# Altium project Mainboard.PrjPcb (part 1 of 2)
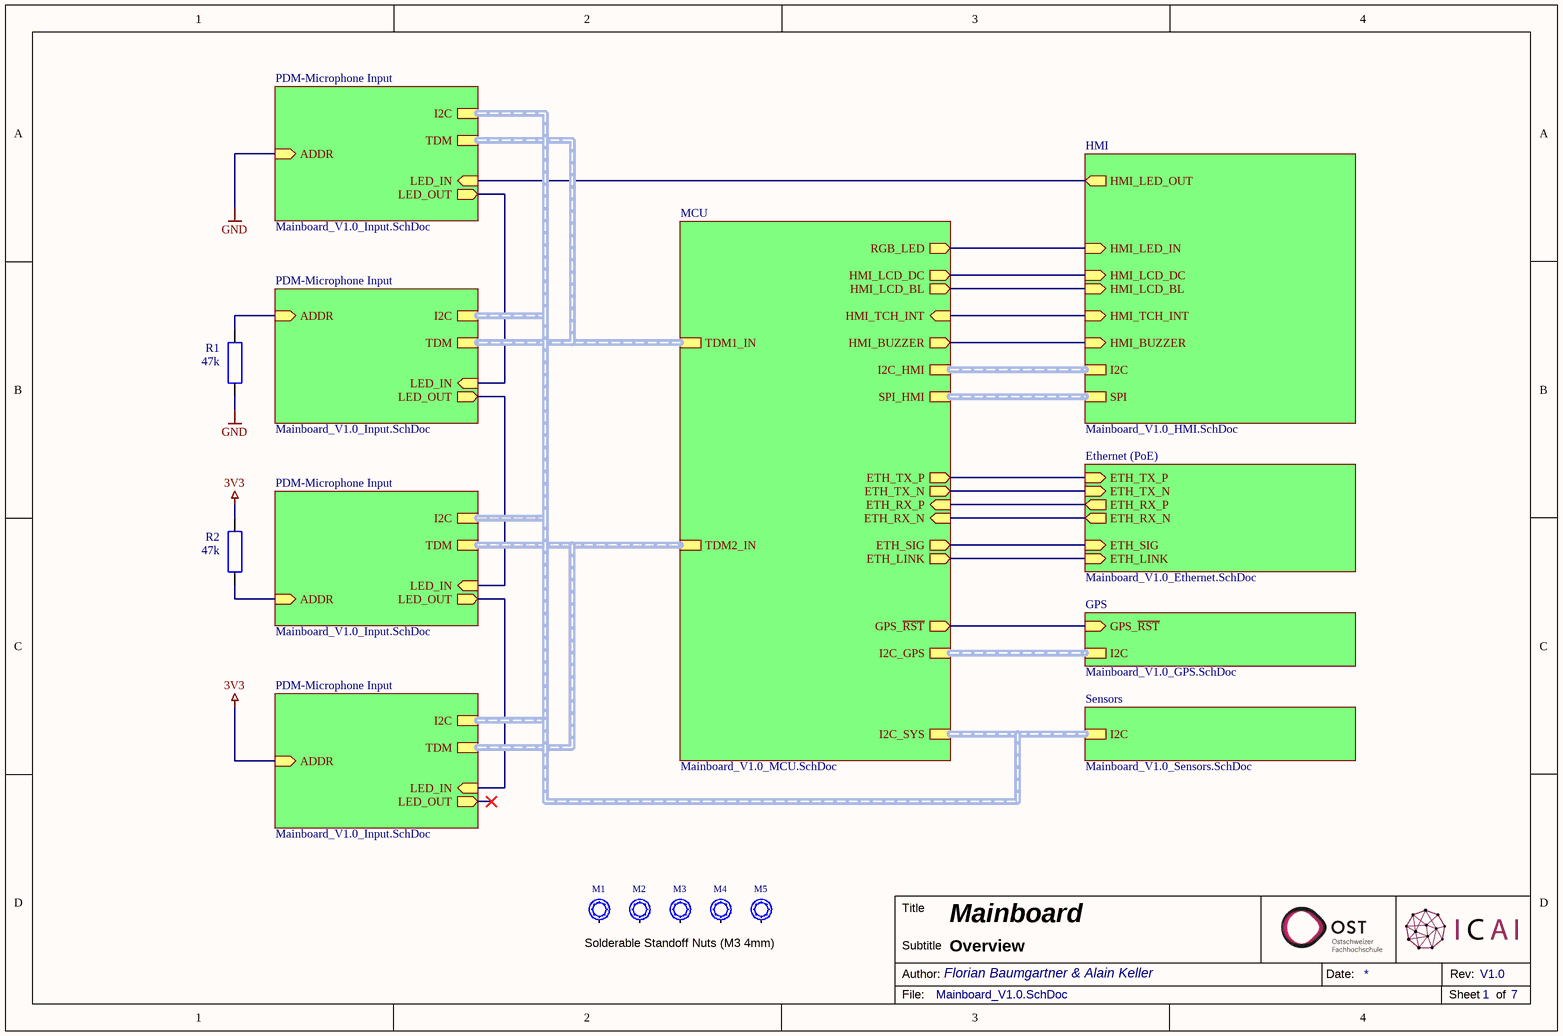
[diagram p0: Mainboard_V1.0.SchDoc]
7 sheets, 216 parts. Net scope: hierarchical (ports join the sheet entries above them; power ports are global).
Board file: Mainboard_V1.0.PcbDoc
Sheets:
  Mainboard_V1.0.SchDoc
    PDM-Microphone Input = Mainboard_V1.0_Input.SchDoc
    PDM-Microphone Input = Mainboard_V1.0_Input.SchDoc
    PDM-Microphone Input = Mainboard_V1.0_Input.SchDoc
    PDM-Microphone Input = Mainboard_V1.0_Input.SchDoc
    HMI = Mainboard_V1.0_HMI.SchDoc
    MCU = Mainboard_V1.0_MCU.SchDoc
    GPS = Mainboard_V1.0_GPS.SchDoc
    Sensors = Mainboard_V1.0_Sensors.SchDoc
    Ethernet (PoE) = Mainboard_V1.0_Ethernet.SchDoc

## Sheet Mainboard_V1.0.SchDoc: Mainboard
size A4; PageSetup: Record=PageOptions|CenterHorizontal=True|CenterVertical=True|PrintScale=0.97|XCorrection=1.00|YCorrection=1.00|PrintKind=0|BorderSize=5000000|LeftOffset=0|BottomOffset=0|Orientation=2|PaperLength=1000|PaperWidth=1000|Scale=100|PaperSource=7|PrintQuality=-3|MediaType=1|DitherType=10|PrintScaleMode=1|PaperKind=A4|PaperIndex=9; Organization: Ostschweizer Fachhochschule; Address2: Florian Baumgartner & Alain Keller; Address3: florian.baumgartner@ost.ch; DocumentNumber: 1; Revision: V1.0; SheetNumber: 1; SheetTotal: 7; Author: Florian Baumgartner & Alain Keller; Subtitle: Overview

### Parts
M1  SMTSO-M3-3ET  [SMD Solder-Nut (M3 4mm)]  (value not drawn)
M2  SMTSO-M3-3ET  [SMD Solder-Nut (M3 4mm)]  (value not drawn)
M3  SMTSO-M3-3ET  [SMD Solder-Nut (M3 4mm)]  (value not drawn)
M4  SMTSO-M3-3ET  [SMD Solder-Nut (M3 4mm)]  (value not drawn)
M5  SMTSO-M3-3ET  [SMD Solder-Nut (M3 4mm)]  (value not drawn)
R1  47k  [SMD Widerstand 0603]
R2  47k  [SMD Widerstand 0603]

### Sub-sheets
Ethernet (PoE) = Mainboard_V1.0_Ethernet.SchDoc: ETH_SIG (in), ETH_TX_P (in), ETH_RX_N (out), ETH_LINK (in), ETH_TX_N (in), ETH_RX_P (out)
GPS = Mainboard_V1.0_GPS.SchDoc: GPS_~{RST} (in), I2C (harness I2C)
HMI = Mainboard_V1.0_HMI.SchDoc: HMI_LCD_DC (in), HMI_TCH_INT (in), HMI_LED_IN (in), HMI_BUZZER (in), HMI_LCD_BL (in), HMI_LED_OUT (out), SPI (harness SPI), I2C (harness I2C)
MCU = Mainboard_V1.0_MCU.SchDoc: I2C_SYS (harness I2C_SYS), RGB_LED (out), I2C_HMI (harness I2C_HMI), SPI_HMI (harness SPI), TDM1_IN (harness TDM1_IN), TDM2_IN (harness TDM2_IN), GPS_~{RST} (out), HMI_BUZZER (out), ETH_TX_N (out), ETH_LINK (out), ETH_SIG (out), HMI_LCD_BL (out), ETH_TX_P (out), HMI_LCD_DC (out), ETH_RX_P (in), ETH_RX_N (in), HMI_TCH_INT (in), I2C_GPS (harness I2C_SYS)
PDM-Microphone Input = Mainboard_V1.0_Input.SchDoc: I2C (harness I2C), LED_IN (in), TDM (harness TDM), LED_OUT (out), ADDR (in)
PDM-Microphone Input = Mainboard_V1.0_Input.SchDoc: I2C (harness I2C), LED_IN (in), TDM (harness TDM), LED_OUT (out), ADDR (in)
PDM-Microphone Input = Mainboard_V1.0_Input.SchDoc: I2C (harness I2C), LED_IN (in), TDM (harness TDM), LED_OUT (out), ADDR (in)
PDM-Microphone Input = Mainboard_V1.0_Input.SchDoc: I2C (harness I2C), LED_IN (in), TDM (harness TDM), LED_OUT (out), ADDR (in)
Sensors = Mainboard_V1.0_Sensors.SchDoc: I2C (harness I2C)

### Nets
3V3: R2.2 ; sheet PDM-Microphone Input/ADDR
GND: R1.1 ; sheet PDM-Microphone Input/ADDR
ETH_RX_N: sheet MCU/ETH_RX_N, sheet Ethernet (PoE)/ETH_RX_N
ETH_RX_P: sheet MCU/ETH_RX_P, sheet Ethernet (PoE)/ETH_RX_P
ETH_SIG: sheet MCU/ETH_SIG, sheet Ethernet (PoE)/ETH_SIG
ETH_TX_N: sheet MCU/ETH_TX_N, sheet Ethernet (PoE)/ETH_TX_N
ETH_TX_P: sheet MCU/ETH_TX_P, sheet Ethernet (PoE)/ETH_TX_P
GPS_~{RST}: sheet MCU/GPS_~{RST}, sheet GPS/GPS_~{RST}
HMI_BUZZER: sheet HMI/HMI_BUZZER, sheet MCU/HMI_BUZZER
HMI_LCD_BL: sheet HMI/HMI_LCD_BL, sheet MCU/HMI_LCD_BL
HMI_LCD_DC: sheet HMI/HMI_LCD_DC, sheet MCU/HMI_LCD_DC
HMI_TCH_~{INT}: sheet HMI/HMI_TCH_INT, sheet MCU/HMI_TCH_INT
RGB_LED: sheet HMI/HMI_LED_IN, sheet MCU/RGB_LED
NetP20_2: sheet PDM-Microphone Input/LED_IN, sheet HMI/HMI_LED_OUT
NetR1_2: R1.2 ; sheet PDM-Microphone Input/ADDR
NetR2_1: R2.1 ; sheet PDM-Microphone Input/ADDR
NetR5_1: sheet MCU/ETH_LINK, sheet Ethernet (PoE)/ETH_LINK
NetX8A_6: sheet PDM-Microphone Input/LED_IN, sheet PDM-Microphone Input/LED_OUT
NetX8B_6: sheet PDM-Microphone Input/LED_IN, sheet PDM-Microphone Input/LED_OUT
NetX8C_6: sheet PDM-Microphone Input/LED_IN, sheet PDM-Microphone Input/LED_OUT

Not connected (* = marked no-connect by the designer): M1 1; M2 1; M3 1; M4 1; M5 1

### Buses and harness runs
harness sheet GPS/I2C = sheet MCU/I2C_GPS
harness sheet HMI/I2C = sheet MCU/I2C_HMI
harness sheet HMI/SPI = sheet MCU/SPI_HMI
harness sheet MCU/I2C_SYS = sheet PDM-Microphone Input/I2C = sheet Sensors/I2C
harness sheet MCU/TDM1_IN = sheet PDM-Microphone Input/TDM
harness sheet MCU/TDM2_IN = sheet PDM-Microphone Input/TDM

### Notes on the sheet
- Solderable Standoff Nuts (M3 4mm)
- Title
- Author:
- Subtitle
- Date:
- Rev:
- File:
- Sheet
- of

### Library data of the parts
M1-M5 = M-Spacer_M3_3mm: Solderable Standoff Nut; Component Value: M3 4mm; Mouser: 153-SMTSO-M3-4ET; Component Description: Solderable Standoff Nut; Unit Price: 0.06; JLC-Parts: C2915635; ComponentLink1Description: Datasheet; ComponentLink1URL: https://datasheet.lcsc.com/lcsc/2111221230_Sinhoo-SMTSO3040CTJ_C2915635.pdf
R1 R2 = R-RESISTOR: RES (E=Heizwiderstand B=Messwandler); Component Description: Thick Film Chip Resistor; Component Value: 47k (75V, 100mW, 1%); Digikey: P47.0KHCT-ND; Farnell: 2303213; Mouser: 667-ERJ-3EKF4702V; JLC-Parts: C25819; Unit Price: 0.01

## Sheet Mainboard_V1.0_Input.SchDoc: Mainboard
size A4; PageSetup: Record=PageOptions|CenterHorizontal=True|CenterVertical=True|PrintScale=0.97|XCorrection=1.00|YCorrection=1.00|PrintKind=0|BorderSize=5000000|LeftOffset=0|BottomOffset=0|Orientation=2|PaperLength=1000|PaperWidth=1000|Scale=100|PaperSource=7|PrintQuality=-3|MediaType=1|DitherType=10|PrintScaleMode=1|PaperKind=A4|PaperIndex=9; Organization: Ostschweizer Fachhochschule; Address2: Florian Baumgartner & Thierry Schwaller; Address3: florian.baumgartner@ost.ch; DocumentNumber: 3; Revision: V1.0; SheetNumber: 3; SheetTotal: 7; Author: Florian Baumgartner & Alain Keller; Subtitle: PDM-Microphone Input
Used 4 times, as channels PDM-Microphone Input, PDM-Microphone Input, PDM-Microphone Input, PDM-Microphone Input. Parts and nets are listed once, with the designators drawn on the sheet.
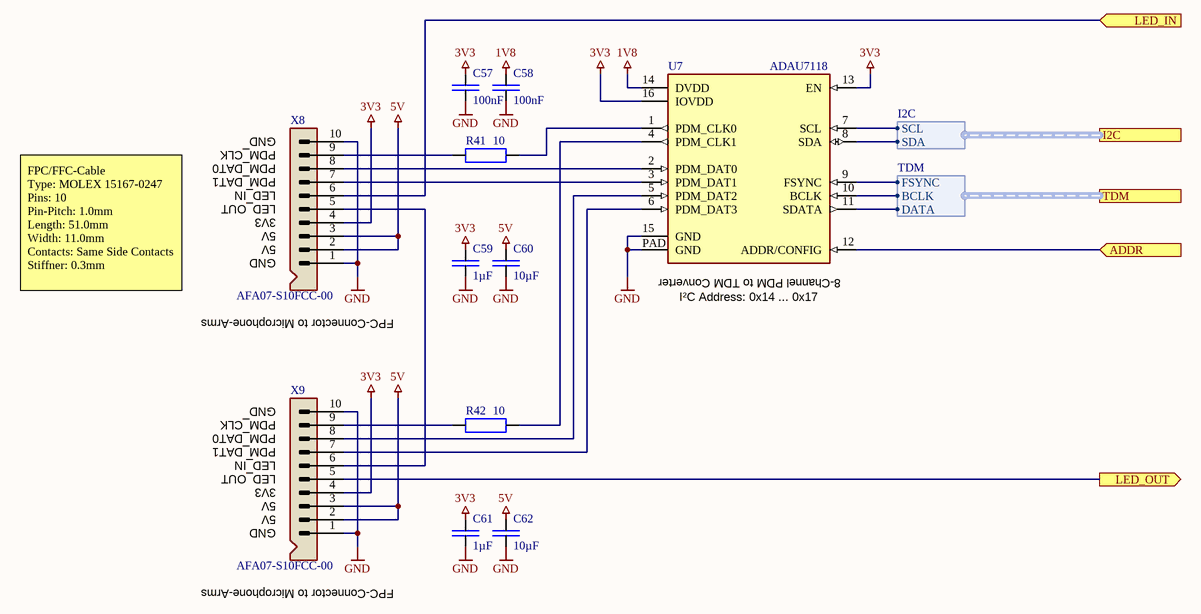
[diagram p1: Mainboard_V1.0_Input.SchDoc]

### Parts
C57  100nF  [SMD Keramikkondensator 0603]
C58  100nF  [SMD Keramikkondensator 0603]
C59  1µF  [SMD Keramikkondensator 0603]
C60  10µF  [SMD Keramikkondensator 1206]
C61  1µF  [SMD Keramikkondensator 0603]
C62  10µF  [SMD Keramikkondensator 1206]
R41  10  [SMD Widerstand 0603]
R42  10  [SMD Widerstand 0603]
U7  ADAU7118  [SMD IC QFN-16]
X8  AFA07-S10FCC-00  [SMD Connector (AFA07-S10FCC-00)]
X9  AFA07-S10FCC-00  [SMD Connector (AFA07-S10FCC-00)]

### Ports
ADDR (in), I2C (harness I2C), LED_IN (in), LED_OUT (out), TDM (harness TDM)

### Harnesses
TDM: BCLK, FSYNC, DATA
I2C: SCL, SDA

### Nets
1V8: C58.2 U7.14(DVDD)
3V3: C57.2 C59.2 C61.2 U7.13(EN) U7.16(IOVDD) X8.4 X9.4
5V: C60.2 C62.2 X8.2 X8.3 X9.2 X9.3
GND: C57.1 C58.1 C59.1 C60.1 C61.1 C62.1 U7.15(GND) U7.PAD(GND) X8.1 X8.10 X9.1 X9.10
ADDR: U7.12(ADDR/CONFIG) ; port ADDR
LED_IN: X8.6 ; port LED_IN
LED_OUT: X9.5 ; port LED_OUT
NetR41_1: R41.1 U7.1(PDM_CLK0)
NetR41_2: R41.2 X8.9
NetR42_1: R42.1 U7.4(PDM_CLK1)
NetR42_2: R42.2 X9.9
NetU7_2: U7.2(PDM_DAT0) X8.8
NetU7_3: U7.3(PDM_DAT1) X8.7
NetU7_5: U7.5(PDM_DAT2) X9.8
NetU7_6: U7.6(PDM_DAT3) X9.7
NetU7_7: U7.7(SCL) ; port I2C.SCL
NetU7_8: U7.8(SDA) ; port I2C.SDA
NetU7_9: U7.9(NC) ; port TDM.FSYNC
NetU7_10: U7.10(NC) ; port TDM.BCLK
NetU7_11: U7.11(NC) ; port TDM.DATA
NetX8_5: X8.5 X9.6

### Channels
PDM-Microphone Input: designators end in A; ports ADDR=3V3 LED_IN=NetX8A_6 LED_OUT=NetX9A_5
PDM-Microphone Input: designators end in B; ports ADDR=NetR2_1 LED_IN=NetX8B_6 LED_OUT=NetX8A_6
PDM-Microphone Input: designators end in C; ports ADDR=NetR1_2 LED_IN=NetX8C_6 LED_OUT=NetX8B_6
PDM-Microphone Input: designators end in D; ports ADDR=GND LED_IN=NetP20_2 LED_OUT=NetX8C_6

### Notes on the sheet
- (near X8) PDM_CLK
- (near X8) PDM_DAT0
- (near X8) PDM_DAT1
- (near X8) GND
- (near X8) LED_IN
- (near X8) LED_OUT
- (near X8) 5V
- (near X8) 3V3
- FPC/FFC-Cable
  Type: MOLEX 15167-0247
  Pins: 10
  Pin-Pitch: 1.0mm
  Length: 51.0mm
  Width: 11.0mm
  Contacts: Same Side Contacts
  Stiffner: 0.3mm
- Digikey <https://www.digikey.ch/de/products/detail/molex/0151670247/3281500>
- Farnell <https://ch.farnell.com/molex/15167-0247/konf-kabel-10-adrig-51mm-weiss/dp/2096091>
- Mouser <https://www.mouser.ch/ProductDetail/Molex/15167-0247?qs=N2VrfF4LzQc0wWLu7%252Bq4SQ%3D%3D>
- FPC-Connector to Microphone-Arms
- (near U7) 8-Channel PDM to TDM Converter
- (near U7) I²C Address: 0x14 ... 0x17
- (near X9) PDM_CLK
- (near X9) PDM_DAT0
- (near X9) PDM_DAT1
- (near X9) GND
- (near X9) LED_IN
- (near X9) LED_OUT
- (near X9) 5V
- (near X9) 3V3
- Title
- Author:
- Subtitle
- Date:
- Rev:
- File:
- Sheet
- of

### Library data of the parts
C57 C58 = E6 - 100nF: SMD Ceramic Capacitor E6; Component Value: 100nF 50V; Component Description: Multilayer Ceramic Capacitors; ComponentLink1Description: Datasheet; ComponentLink1URL: https://datasheet.lcsc.com/lcsc/1809301912_YAGEO-CC0603KRX7R9BB104_C14663.pdf; Digikey: 445-5666-1-ND; Farnell: 2522432; JLC-Parts: C14663; Mouser: 77-VJ0603V104ZXAPBC; Unit Price: 0.01
C59 C61 = C-CAPACITOR: CAP-MK; Component Description: Multilayer Ceramic Capacitors; Component Value: 1µF 50V; Digikey: 1276-1860-1-ND; Farnell: 3013383; Mouser: 187-CL10A105KB8NNNC; JLC-Parts: C15849; Unit Price: 0.01
C60 C62 = E6 - 10uF: SMD Ceramic Capacitor E6; Component Value: 10µF 50V; Component Description: Multilayer Ceramic Capacitors MLCC; ComponentLink1Description: Datasheet; ComponentLink1URL: https://datasheet.lcsc.com/lcsc/1810191219_Samsung-Electro-Mechanics-CL10A106KP8NNNC_C19702.pdf; Digikey: 587-3258-1-ND; Farnell: 2113070; JLC-Parts: C13585; Mouser: 963-LMK107BBJ106MALT; Unit Price: 0.01
R41 R42 = R-RESISTOR: RES (E=Heizwiderstand B=Messwandler); Component Description: Thick Film Chip Resistor; Component Value: 10 (75V, 100mW, 1%); Digikey: P10.0HCT-ND; Farnell: 2302958; Mouser: 667-ERJ-3EKF10R0V; JLC-Parts: C22859; Unit Price: 0.01
U7 = U-ADAU7118: 8-Channel PDM to I²S/TDM Converter; Component Value: ADAU7118ACPZRL; ComponentLink1Description: Datasheet; ComponentLink1URL: https://www.analog.com/media/en/technical-documentation/data-sheets/ADAU7118.pdf; Digikey: 505-ADAU7118ACPZRLCT-ND; Farnell: 4033291; JLC-Parts: C654437; Mouser: 584-ADAU7118ACPZRL; Unit Price: 6.20; Component Description: 8-Channel PDM to I²S/TDM Converter
X8 X9 = X-FPC-Connector (10-Pin): FPC-Connector (10-Pin, Slide-Lock,  Bottom Contact); Digikey: 2073-FFC3B07-10-TCT-ND; Farnell: 3873345; Mouser: 640-FFC3B07-10-T; Component Description: FPC-Connector (10-Pin, Slide-Lock,  Bottom Contact); Component Value: AFA07-S10FCC-00; JLC-Parts: C52162; Unit Price: 0.09; ComponentLink1Description: Datasheet; ComponentLink1URL: https://datasheet.lcsc.com/lcsc/1811142212_JUSHUO-AFA07-S10FCC-00_C52162.pdf

## Sheet Mainboard_V1.0_HMI.SchDoc: Mainboard
size A4; PageSetup: Record=PageOptions|CenterHorizontal=True|CenterVertical=True|PrintScale=0.97|XCorrection=1.00|YCorrection=1.00|PrintKind=0|BorderSize=5000000|LeftOffset=0|BottomOffset=0|Orientation=2|PaperLength=1000|PaperWidth=1000|Scale=100|PaperSource=7|PrintQuality=-3|MediaType=1|DitherType=10|PrintScaleMode=1|PaperKind=A4|PaperIndex=9; Organization: Ostschweizer Fachhochschule; Address2: Florian Baumgartner & Thierry Schwaller; Address3: florian.baumgartner@ost.ch; DocumentNumber: 6; Revision: V1.0; SheetNumber: 6; SheetTotal: 7; Author: Florian Baumgartner & Alain Keller; Subtitle: HMI
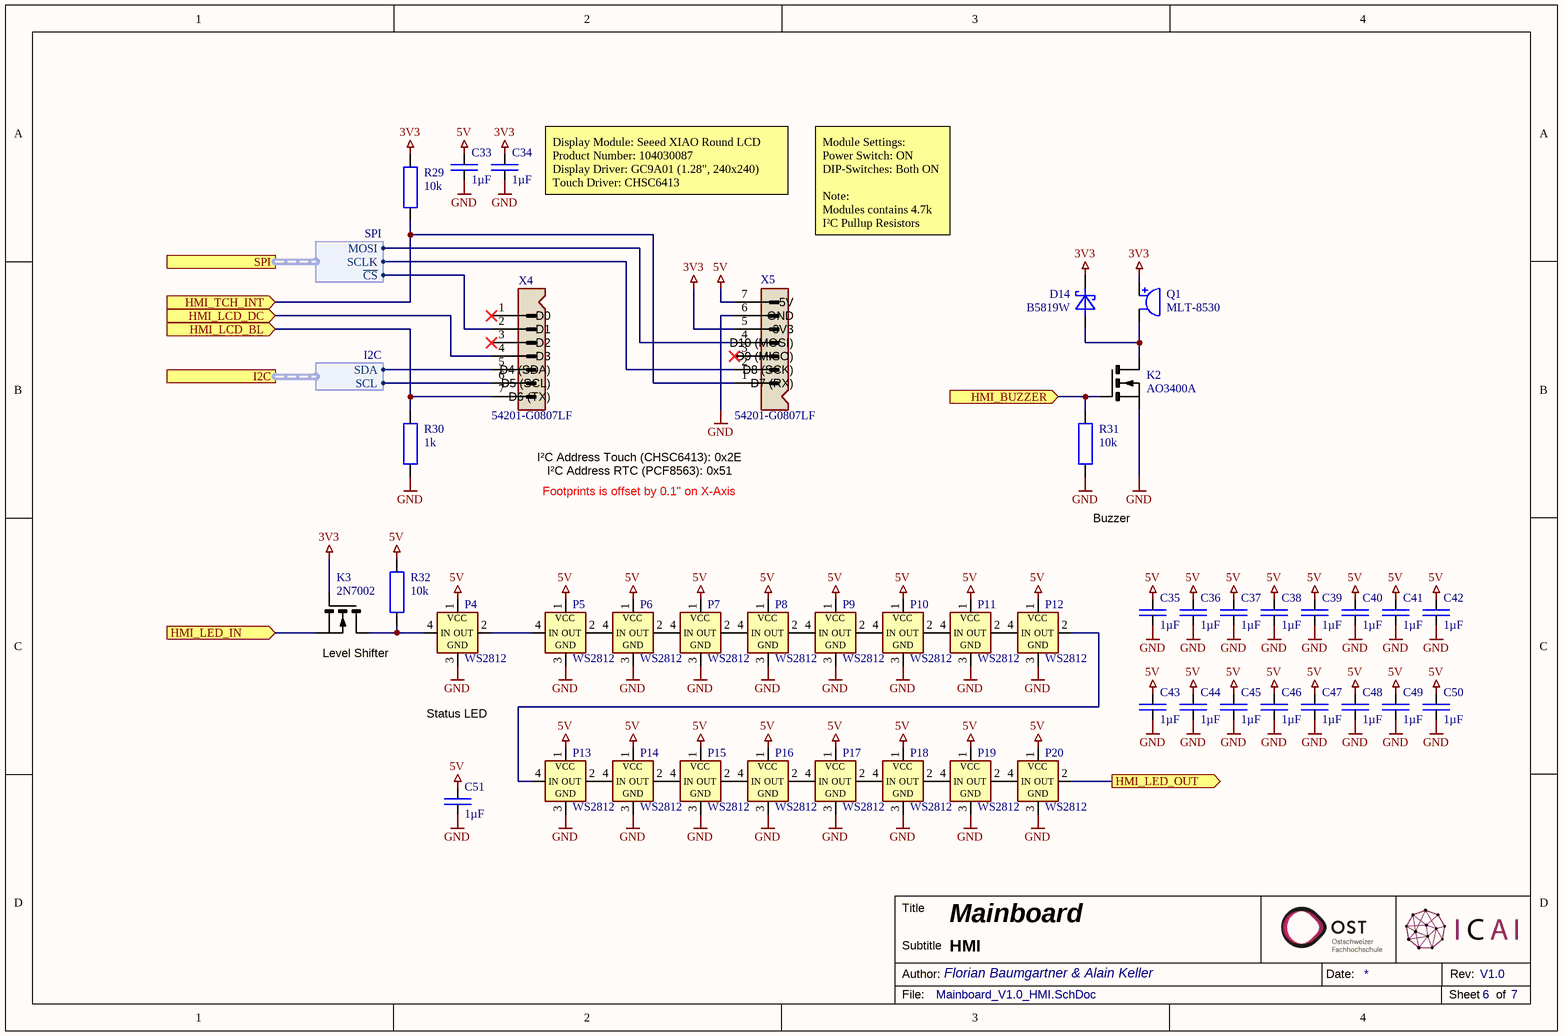
[diagram p2: Mainboard_V1.0_HMI.SchDoc]

### Parts
C33  1µF  [SMD Keramikkondensator 0603]
C34  1µF  [SMD Keramikkondensator 0603]
C35  1µF  [SMD Keramikkondensator 0603]
C36  1µF  [SMD Keramikkondensator 0603]
C37  1µF  [SMD Keramikkondensator 0603]
C38  1µF  [SMD Keramikkondensator 0603]
C39  1µF  [SMD Keramikkondensator 0603]
C40  1µF  [SMD Keramikkondensator 0603]
C41  1µF  [SMD Keramikkondensator 0603]
C42  1µF  [SMD Keramikkondensator 0603]
C43  1µF  [SMD Keramikkondensator 0603]
C44  1µF  [SMD Keramikkondensator 0603]
C45  1µF  [SMD Keramikkondensator 0603]
C46  1µF  [SMD Keramikkondensator 0603]
C47  1µF  [SMD Keramikkondensator 0603]
C48  1µF  [SMD Keramikkondensator 0603]
C49  1µF  [SMD Keramikkondensator 0603]
C50  1µF  [SMD Keramikkondensator 0603]
C51  1µF  [SMD Keramikkondensator 0603]
D14  B5819W  [SMD Diode SOD-123]
K2  AO3400A  [SMD MOSFET SOT-23]
K3  2N7002  [SMD MOSFET SOT-23]
P4  WS2812  [SMD LED WS2812B-0807]
P5  WS2812  [SMD LED WS2812B-0807]
P6  WS2812  [SMD LED WS2812B-0807]
P7  WS2812  [SMD LED WS2812B-0807]
P8  WS2812  [SMD LED WS2812B-0807]
P9  WS2812  [SMD LED WS2812B-0807]
P10  WS2812  [SMD LED WS2812B-0807]
P11  WS2812  [SMD LED WS2812B-0807]
P12  WS2812  [SMD LED WS2812B-0807]
P13  WS2812  [SMD LED WS2812B-0807]
P14  WS2812  [SMD LED WS2812B-0807]
P15  WS2812  [SMD LED WS2812B-0807]
P16  WS2812  [SMD LED WS2812B-0807]
P17  WS2812  [SMD LED WS2812B-0807]
P18  WS2812  [SMD LED WS2812B-0807]
P19  WS2812  [SMD LED WS2812B-0807]
P20  WS2812  [SMD LED WS2812B-0807]
Q1  MLT-8530  [SMD Buzzer (MLT-8530)]
R29  10k  [SMD Widerstand 0603]
R30  1k  [SMD Widerstand 0603]
R31  10k  [SMD Widerstand 0603]
R32  10k  [SMD Widerstand 0603]
X4  54201-G0807LF  [SMD Pin-Header 1x7]
X5  54201-G0807LF  [SMD Pin-Header 1x7]

### Ports
HMI_BUZZER (in), HMI_LCD_BL (in), HMI_LCD_DC (in), HMI_LED_IN (in), HMI_LED_OUT (out), HMI_TCH_INT (in), I2C (harness I2C), SPI (harness SPI)

### Harnesses
SPI: SCLK, MOSI, ~{CS}
I2C: SCL, SDA

### Nets
3V3: C34.2 D14.K K3.G Q1.1(P) R29.2 X5.5
5V: C33.2 C35.2 C36.2 C37.2 C38.2 C39.2 C40.2 C41.2 C42.2 C43.2 C44.2 C45.2 C46.2 C47.2 C48.2 C49.2 C50.2 C51.2 P4.1(VCC) P5.1(VCC) P6.1(VCC) P7.1(VCC) P8.1(VCC) P9.1(VCC) P10.1(VCC) P11.1(VCC) P12.1(VCC) P13.1(VCC) P14.1(VCC) P15.1(VCC) P16.1(VCC) P17.1(VCC) P18.1(VCC) P19.1(VCC) P20.1(VCC) R32.2 X5.7
GND: C33.1 C34.1 C35.1 C36.1 C37.1 C38.1 C39.1 C40.1 C41.1 C42.1 C43.1 C44.1 C45.1 C46.1 C47.1 C48.1 C49.1 C50.1 C51.1 K2.S P4.3(GND) P5.3(GND) P6.3(GND) P7.3(GND) P8.3(GND) P9.3(GND) P10.3(GND) P11.3(GND) P12.3(GND) P13.3(GND) P14.3(GND) P15.3(GND) P16.3(GND) P17.3(GND) P18.3(GND) P19.3(GND) P20.3(GND) R30.1 R31.1 X5.6
HMI_BUZZER: K2.G R31.2 ; port HMI_BUZZER
HMI_LCD_BL: R30.2 X4.7 ; port HMI_LCD_BL
HMI_LCD_~{CS}: X4.2 ; port SPI.~{CS}
HMI_LCD_DC: X4.4 ; port HMI_LCD_DC
HMI_LCD_MOSI: X5.4 ; port SPI.MOSI
HMI_LCD_SCLK: X5.2 ; port SPI.SCLK
HMI_TCH_~{INT}: R29.1 X5.1 ; port HMI_TCH_INT
RGB_LED: K3.S ; port HMI_LED_IN
SCL_HMI: X4.6 ; port I2C.SCL
SDA_HMI: X4.5 ; port I2C.SDA
NetD14_A: D14.A K2.D Q1.2(M)
NetK3_D: K3.D P4.4(IN) R32.1
NetP4_2: P4.2(OUT) P5.4(IN)
NetP5_2: P5.2(OUT) P6.4(IN)
NetP6_2: P6.2(OUT) P7.4(IN)
NetP7_2: P7.2(OUT) P8.4(IN)
NetP8_2: P8.2(OUT) P9.4(IN)
NetP9_2: P9.2(OUT) P10.4(IN)
NetP10_2: P10.2(OUT) P11.4(IN)
NetP11_2: P11.2(OUT) P12.4(IN)
NetP12_2: P12.2(OUT) P13.4(IN)
NetP13_2: P13.2(OUT) P14.4(IN)
NetP14_2: P14.2(OUT) P15.4(IN)
NetP15_2: P15.2(OUT) P16.4(IN)
NetP16_2: P16.2(OUT) P17.4(IN)
NetP17_2: P17.2(OUT) P18.4(IN)
NetP18_2: P18.2(OUT) P19.4(IN)
NetP19_2: P19.2(OUT) P20.4(IN)
NetP20_2: P20.2(OUT) ; port HMI_LED_OUT

Not connected (* = marked no-connect by the designer): X4 1* 3*; X5 3*

### Notes on the sheet
- (near C34) Display Module: Seeed XIAO Round LCD
  Product Number: 104030087
  Display Driver: GC9A01 (1.28", 240x240)
  Touch Driver: CHSC6413
- Module Settings:
  Power Switch: ON
  DIP-Switches: Both ON
  Note:
  Modules contains 4.7k I²C Pullup Resistors
- (near X4) D0
- (near X5) 5V
- (near X5) GND
- (near X4) D1
- (near X4) D2
- (near X4) D3
- (near X4) D4 (SDA)
- (near X4) D5 (SCL)
- (near X5) D7 (RX)
- (near X5) D8 (SCK)
- (near X5) D9 (MISO)
- (near X5) D10 (MOSI)
- (near X5) 3V3
- (near X4) D6 (TX)
- I²C Address RTC (PCF8563): 0x51
- I²C Address Touch (CHSC6413): 0x2E
- Footprints is offset by 0.1" on X-Axis
- (near R31) Buzzer
- (near K3) Level Shifter
- Status LED
- Title
- Author:
- Subtitle
- Date:
- Rev:
- File:
- Sheet
- of

### Library data of the parts
C33-C51 = C-CAPACITOR: as C59 on sheet Mainboard_V1.0_Input; Digikey: 1276-1860-1-ND; Farnell: 3013383; Mouser: 187-CL10A105KB8NNNC; JLC-Parts: C15849; Unit Price: 0.01
D14 = R-DIODE:SCHKY: S-DIODE; Component Description: Low Voltage Schottky-Diode; Mouser: 833-B5819W-TP; Farnell: 2306459; Digikey: B5819W-TPMSCT-ND; JLC-Parts: C8598; Component Value: B5819W; Unit Price: 0.03
K2 K3 = K-FET:NIGE: MOSFET N-Channel; ComponentLink1Description: Datasheet; Component Description: MOSFET N-Channel
  K2: Digikey: 785-1000-1-ND; ComponentLink1URL: http://www.aosmd.com/pdfs/datasheet/AO3400A.pdf; Component Value: AO3400A; JLC-Parts: C20917; Unit Price: 0.20
  K3: Digikey: 2N7002NCT-ND; Farnell: 1713823; Mouser: 512-2N7002; ComponentLink1URL: https://datasheet.lcsc.com/lcsc/1810151612_Jiangsu-Changjing-Electronics-Technology-Co---Ltd--2N7002_C8545.pdf; Component Value: 2N7002; JLC-Parts: C8545; Unit Price: 0.02
P4-P20 = P-WS2812B-0807: Smart RGB-LED; aliExpress: 1005003999865721; Component Value: XL-0807RGBC-WS2812B; JLC-Parts: C3646929; ComponentLink1Description: Datasheet; ComponentLink1URL: https://datasheet.lcsc.com/lcsc/2108251530_OPSCO-Optoelectronics-SK6812D-EC3210R_C2890041.pdf; Component Description: Smart RGB-LED; Unit Price: 0.07
Q1 = Q-Buzzer: Electromagnetic Buzzer; Digikey: 458-1052-ND; Farnell: 1801084; Mouser: 539-AST200Q; JLC-Parts: C94599; ComponentLink1Description: Datasheet; ComponentLink1URL: https://datasheet.lcsc.com/lcsc/1811151451_Jiangsu-Huaneng-Elec-MLT-8530_C94599.pdf; Component Description: Electromagnetic Buzzer; Component Value: MLT-8530; Unit Price: 0.27
R29 R31 R32 = R-RESISTOR: RES (E=Heizwiderstand B=Messwandler); Component Description: Thick Film Chip Resistor; Component Value: 10k (75V, 100mW, 1%); Digikey: P10.0KHCT-ND; Farnell: 2303192; Mouser: 667-ERJ-3EKF1002V; JLC-Parts: C25804; Unit Price: 0.01
R30 = R-RESISTOR: RES (E=Heizwiderstand B=Messwandler); Component Description: Dickschicht Chipwiderstand; Component Value: 1k (75V, 100mW, 1%); Digikey: P1.00KHCT-ND; Farnell: 2303145; Mouser: 667-ERJ-3EKF1001V; JLC-Parts: C21190; Unit Price: 0.01
X4 X5 = X-Stiftleiste (7-Fach): Component Description: Pin Header SMD; Digikey: 609-54201-G0807LF-ND; Mouser: 649-54201-G0807ALF; ComponentLink1Description: Datasheet; ComponentLink1URL: https://cdn.amphenol-cs.com/media/wysiwyg/files/documentation/datasheet/boardwiretoboard/bwb_bergstik.pdf; Component Value: 54201-G0807LF; Unit Price: 1.32

## Sheet Mainboard_V1.0_MCU.SchDoc: Mainboard
size A4; PageSetup: Record=PageOptions|CenterHorizontal=True|CenterVertical=True|PrintScale=0.97|XCorrection=1.00|YCorrection=1.00|PrintKind=0|BorderSize=5000000|LeftOffset=0|BottomOffset=0|Orientation=2|PaperLength=1000|PaperWidth=1000|Scale=100|PaperSource=7|PrintQuality=-3|MediaType=1|DitherType=10|PrintScaleMode=1|PaperKind=A4|PaperIndex=9; Organization: Ostschweizer Fachhochschule; Address2: Florian Baumgartner & Thierry Schwaller; Address3: florian.baumgartner@ost.ch; DocumentNumber: 2; Revision: V1.0; SheetNumber: 2; SheetTotal: 7; Author: Florian Baumgartner & Alain Keller; Subtitle: MCU
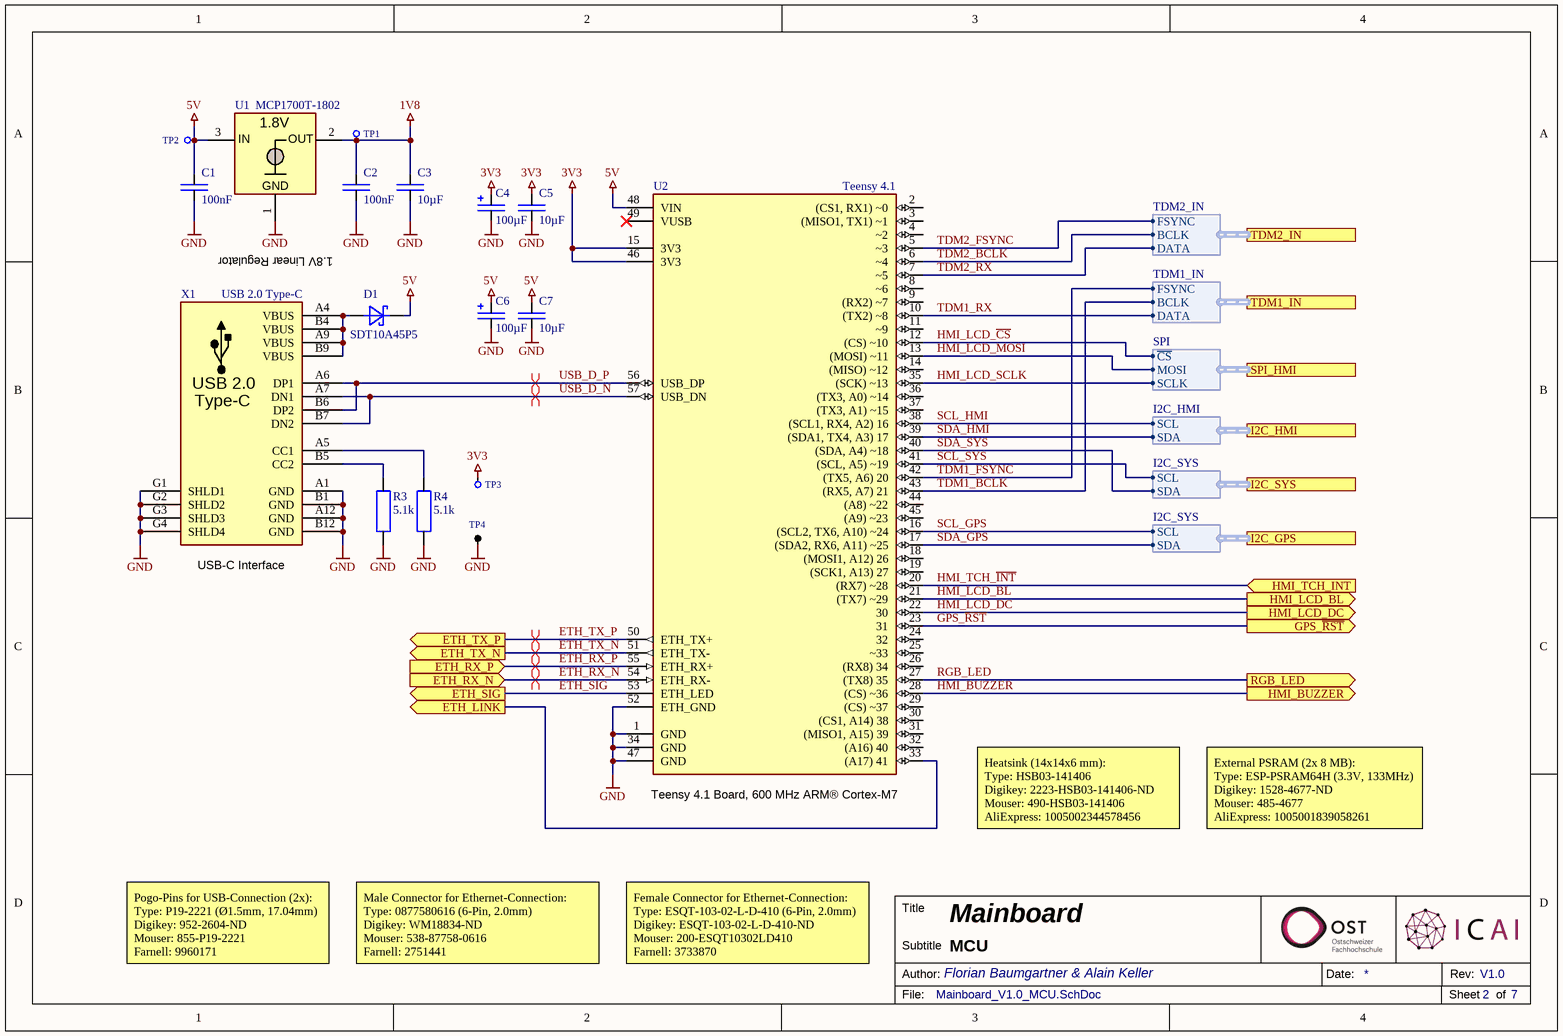
[diagram p3: Mainboard_V1.0_MCU.SchDoc]

### Parts
C1  100nF  [SMD Keramikkondensator 0603]
C2  100nF  [SMD Keramikkondensator 0603]
C3  10µF  [SMD Keramikkondensator 1206]
C4  100µF  [SMD Tantalkondensator 1210 +]
C5  10µF  [SMD Keramikkondensator 1206]
C6  100µF  [SMD Tantalkondensator 1210 +]
C7  10µF  [SMD Keramikkondensator 1206]
D1  SDT10A45P5  [SMD Diode PowerDI-5]
R3  5.1k  [SMD Widerstand 0603]
R4  5.1k  [SMD Widerstand 0603]
TP1  X-TP  [THT Testpunkt Ø1mm]  (value not drawn)  (no BOM)
TP2  X-TP  [THT Testpunkt Ø1mm]  (value not drawn)  (no BOM)
TP3  X-TP  [THT Testpunkt Ø1mm]  (value not drawn)  (no BOM)
TP4  Schwarz  [THT Messpunkt Ø2.54mm Schwarz]  (value not drawn)
U1  MCP1700T-1802  [SMD IC SOT-23-3]
U2  Teensy 4.1  [THT Teensy 4.1]
X1  USB 2.0 Type-C  [THT USB-C Socket (KH-TYPE-C-L10-14P)]

### Ports
ETH_LINK (out), ETH_RX_N (in), ETH_RX_P (in), ETH_SIG (out), ETH_TX_N (out), ETH_TX_P (out), GPS_~{RST} (out), HMI_BUZZER (out), HMI_LCD_BL (out), HMI_LCD_DC (out), HMI_TCH_INT (in), I2C_GPS (harness I2C_SYS), I2C_HMI (harness I2C_HMI), I2C_SYS (harness I2C_SYS), RGB_LED (out), SPI_HMI (harness SPI), TDM1_IN (harness TDM1_IN), TDM2_IN (harness TDM2_IN)

### Harnesses
I2C_HMI: SCL, SDA
TDM1_IN: BCLK, FSYNC, DATA
I2C_SYS: SCL, SDA
TDM2_IN: BCLK, FSYNC, DATA
SPI: SCLK, MOSI, ~{CS}

### Nets
1V8: C2.2 C3.2 TP1.1 U1.2(OUT)
3V3: C4.P(+) C5.2 TP3.1 U2.15(3V3) U2.46(3V3)
5V: C1.2 C6.P(+) C7.2 D1.K TP2.1 U1.3(IN) U2.48(VIN)
GND: C1.1 C2.1 C3.1 C4.M(-) C5.1 C6.M(-) C7.1 R3.2 R4.2 TP4.1 U1.1(GND) U2.1(GND) U2.34(GND) U2.47(GND) U2.52(ETH_GND) X1.A1(GND) X1.A12(GND) X1.B1(GND) X1.B12(GND) X1.G1(SHLD1) X1.G2(SHLD2) X1.G3(SHLD3) X1.G4(SHLD4)
ETH_RX_N: U2.54(ETH_RX-) ; port ETH_RX_N
ETH_RX_P: U2.55(ETH_RX+) ; port ETH_RX_P
ETH_SIG: U2.53(ETH_LED) ; port ETH_SIG
ETH_TX_N: U2.51(ETH_TX-) ; port ETH_TX_N
ETH_TX_P: U2.50(ETH_TX+) ; port ETH_TX_P
GPS_~{RST}: U2.23(31) ; port GPS_~{RST}
HMI_BUZZER: U2.28((CS)_~36) ; port HMI_BUZZER
HMI_LCD_BL: U2.21((TX7)_~29) ; port HMI_LCD_BL
HMI_LCD_~{CS}: U2.12((CS)_~10) ; port SPI_HMI.~{CS}
HMI_LCD_DC: U2.22(30) ; port HMI_LCD_DC
HMI_LCD_MOSI: U2.13((MOSI)_~11) ; port SPI_HMI.MOSI
HMI_LCD_SCLK: U2.35((SCK)_~13) ; port SPI_HMI.SCLK
HMI_TCH_~{INT}: U2.20((RX7)_~28) ; port HMI_TCH_INT
RGB_LED: U2.27((TX8)_35) ; port RGB_LED
SCL_GPS: U2.16((SCL2,_TX6,_A10)_~24) ; port I2C_GPS.SCL
SCL_HMI: U2.38((SCL1,_RX4,_A2)_16) ; port I2C_HMI.SCL
SCL_SYS: U2.41((SCL,_A5)_~19) ; port I2C_SYS.SCL
SDA_GPS: U2.17((SDA2,_RX6,_A11)_~25) ; port I2C_GPS.SDA
SDA_HMI: U2.39((SDA1,_TX4,_A3)_17) ; port I2C_HMI.SDA
SDA_SYS: U2.40((SDA,_A4)_~18) ; port I2C_SYS.SDA
TDM1_BCLK: U2.43((RX5,_A7)_21) ; port TDM1_IN.BCLK
TDM1_FSYNC: U2.42((TX5,_A6)_20) ; port TDM1_IN.FSYNC
TDM1_RX: U2.10(NC) ; port TDM1_IN.DATA
TDM2_BCLK: U2.6(~4) ; port TDM2_IN.BCLK
TDM2_FSYNC: U2.5(~3) ; port TDM2_IN.FSYNC
TDM2_RX: U2.7(~5) ; port TDM2_IN.DATA
USB_D_N: U2.57(USB_DN) X1.A7(DN1) X1.B7(DN2)
USB_D_P: U2.56(USB_DP) X1.A6(DP1) X1.B6(DP2)
NetD1_A: D1.A X1.A4(VBUS) X1.A9(VBUS) X1.B4(VBUS) X1.B9(VBUS)
NetR3_1: R3.1 X1.B5(CC2)
NetR4_1: R4.1 X1.A5(CC1)
NetR5_1: U2.33((A17)_41) ; port ETH_LINK

Not connected (* = marked no-connect by the designer): U2 2((CS1,_RX1)_~0) 3((MISO1,_TX1)_~1) 4(~2) 8(~6) 9(NC) 11(NC) 14((MISO)_~12) 18((MOSI1,_A12)_26) 19((SCK1,_A13)_27) 24(32) 25(~33) 26((RX8)_34) 29((CS)_~37) 30((CS1,_A14)_38) 31((MISO1,_A15)_39) 32((A16)_40) 36((TX3,_A0)_~14) 37((TX3,_A1)_~15) 44((A8)_~22) 45((A9)_~23) 49(VUSB)*

### Layout directives
differential pair: ETH_RX_N, ETH_RX_P, ETH_TX_N, ETH_TX_P, USB_D_N, USB_D_P

### Notes on the sheet
- 1.8V Linear Regulator
- (near X1) USB-C Interface
- (near U2) Teensy 4.1 Board, 600 MHz ARM® Cortex-M7
- Heatsink (14x14x6 mm):
  Type: HSB03-141406
  Digikey: 2223-HSB03-141406-ND
  Mouser: 490-HSB03-141406
  AliExpress: 1005002344578456
- External PSRAM (2x 8 MB):
  Type: ESP-PSRAM64H (3.3V, 133MHz)
  Digikey: 1528-4677-ND
  Mouser: 485-4677
  AliExpress: 1005001839058261
- Pogo-Pins for USB-Connection (2x):
  Type: P19-2221 (Ø1.5mm, 17.04mm)
  Digikey: 952-2604-ND
  Mouser: 855-P19-2221
  Farnell: 9960171
- Male Connector for Ethernet-Connection:
  Type: 0877580616 (6-Pin, 2.0mm)
  Digikey: WM18834-ND
  Mouser: 538-87758-0616
  Farnell: 2751441
- Female Connector for Ethernet-Connection:
  Type: ESQT-103-02-L-D-410 (6-Pin, 2.0mm)
  Digikey: ESQT-103-02-L-D-410-ND
  Mouser: 200-ESQT10302LD410
  Farnell: 3733870
- Title
- Author:
- Subtitle
- Date:
- Rev:
- File:
- Sheet
- of
- (in symbol T-MCP1700T-1.8) 1.8V
- (in symbol X-USB-Buchse_Vertical) USB 2.0

### Library data of the parts
C1 C2 = E6 - 100nF: SMD Ceramic Capacitor E6; Component Value: 100nF 50V; Component Description: Multilayer Ceramic Capacitors MLCC; ComponentLink1Description: Datasheet; ComponentLink1URL: https://datasheet.lcsc.com/lcsc/1809301912_YAGEO-CC0603KRX7R9BB104_C14663.pdf; Digikey: 445-6899-1-ND; Farnell: 2210822; JLC-Parts: C14663; Mouser: 810-CGA2B3X7R1H104K; Unit Price: 0.01
C3 C5 C7 = E6 - 10uF: as C60 on sheet Mainboard_V1.0_Input; ComponentLink1Description: Datasheet; ComponentLink1URL: https://datasheet.lcsc.com/lcsc/1810191219_Samsung-Electro-Mechanics-CL10A106KP8NNNC_C19702.pdf; Digikey: 587-3258-1-ND; Farnell: 2113070; JLC-Parts: C13585; Mouser: 963-LMK107BBJ106MALT; Unit Price: 0.01
C4 C6 = C-ELCAP: CAP-Elko; Component Description: Tantalum Capacitor; Component Value: 100µF 6.3V; Digikey: 478-1677-1-ND; Farnell: 1135048; Mouser: 581-TAJB107K006R; JLC-Parts: C16133; Unit Price: 0.08
D1 = R-DIODE:SCHKY: Trench Schottky Barrier Rectifier; Component Value: SDT10A45P5-13; Mouser: 621-SDT10A45P5-13; Farnell: 3944970; Digikey: 31-SDT10A45P5-13CT-ND; JLC-Parts: C2997843; Component Description: Trench Schottky Barrier Rectifier; Unit Price: 0.19; ComponentLink1Description: Datasheet; ComponentLink1URL: https://www.diodes.com/assets/Datasheets/SDT10A45P5.pdf
R3 R4 = R-RESISTOR: RES (E=Heizwiderstand B=Messwandler); Component Description: Thick Film Chip Resistor; Component Value: 5.1k (75V, 100mW, 1%); Digikey: P5.10KHCT-ND; Farnell: 2059378; Mouser: 667-ERJ-3EKF5101V; JLC-Parts: C23186; Unit Price: 0.01
TP1-TP3 = X-TP: Testpunkt; Component Value: Ø 0.8mm; Component Description: Testpunkt; Unit Price: 0.00
TP4 = X-MP: Messpunkt; Component Description: Ground-Clip; Component Value: Ø 2.54mm (Black); Digikey: 36-5001-ND; Farnell: 2301278; Mouser: 534-5001; JLC-Parts: C238122; Unit Price: 0.36
U1 = T-MCP1700T-1.8: Voltage Regulator; Component Description: Linear Voltage Regulator; Component Value: MCP1700T-1802E (1.8V, 200mA); Digikey: MCP1700T1802ETTCT-ND; Farnell: 1296591; Mouser: 579-MCP1700T1802E/TT; ComponentLink1Description: Datasheet; ComponentLink1URL: https://datasheet.lcsc.com/lcsc/2304140030_Microchip-Tech-MCP1700T-1802E-TT_C150796.pdf; JLC-Parts: C150796; Unit Price: 0.37
U2 = U-Teensy-4.1: RT1062 i.MX ARM® Cortex®-M7 MPU; ComponentLink1Description: Datasheet; ComponentLink1URL: https://mm.digikey.com/Volume0/opasdata/d220001/medias/docus/497/DEV-16771_Web.pdf; Digikey: 1568-DEV-16771-ND; Component Value: Teensy 4.1; Mouser: 474-DEV-16771; Unit Price: 28.70; Component Description: RT1062 i.MX ARM® Cortex®-M7 MPU
X1 = X-USB-Buchse_Vertical: Type-C; aliExpress: 1005003021508194; Component Description: USB Connector Type-C Vertical; Component Value: KH-TYPE-C-L10-14P; ComponentLink1Description: Datasheet; ComponentLink1URL: https://datasheet.lcsc.com/lcsc/2103161911_Shenzhen-Kinghelm-Elec-KH-TYPE-C-L10-14P_C2761226.pdf; JLC-Parts: C2761226; Unit Price: 0.27

## Sheet Mainboard_V1.0_GPS.SchDoc: Mainboard
size A4; PageSetup: Record=PageOptions|CenterHorizontal=True|CenterVertical=True|PrintScale=0.97|XCorrection=1.00|YCorrection=1.00|PrintKind=0|BorderSize=5000000|LeftOffset=0|BottomOffset=0|Orientation=2|PaperLength=1000|PaperWidth=1000|Scale=100|PaperSource=7|PrintQuality=-3|MediaType=1|DitherType=10|PrintScaleMode=1|PaperKind=A4|PaperIndex=9; Organization: Ostschweizer Fachhochschule; Address2: Florian Baumgartner & Thierry Schwaller; Address3: florian.baumgartner@ost.ch; DocumentNumber: 5; Revision: V1.0; SheetNumber: 5; SheetTotal: 7; Author: Florian Baumgartner & Alain Keller; Subtitle: GPS
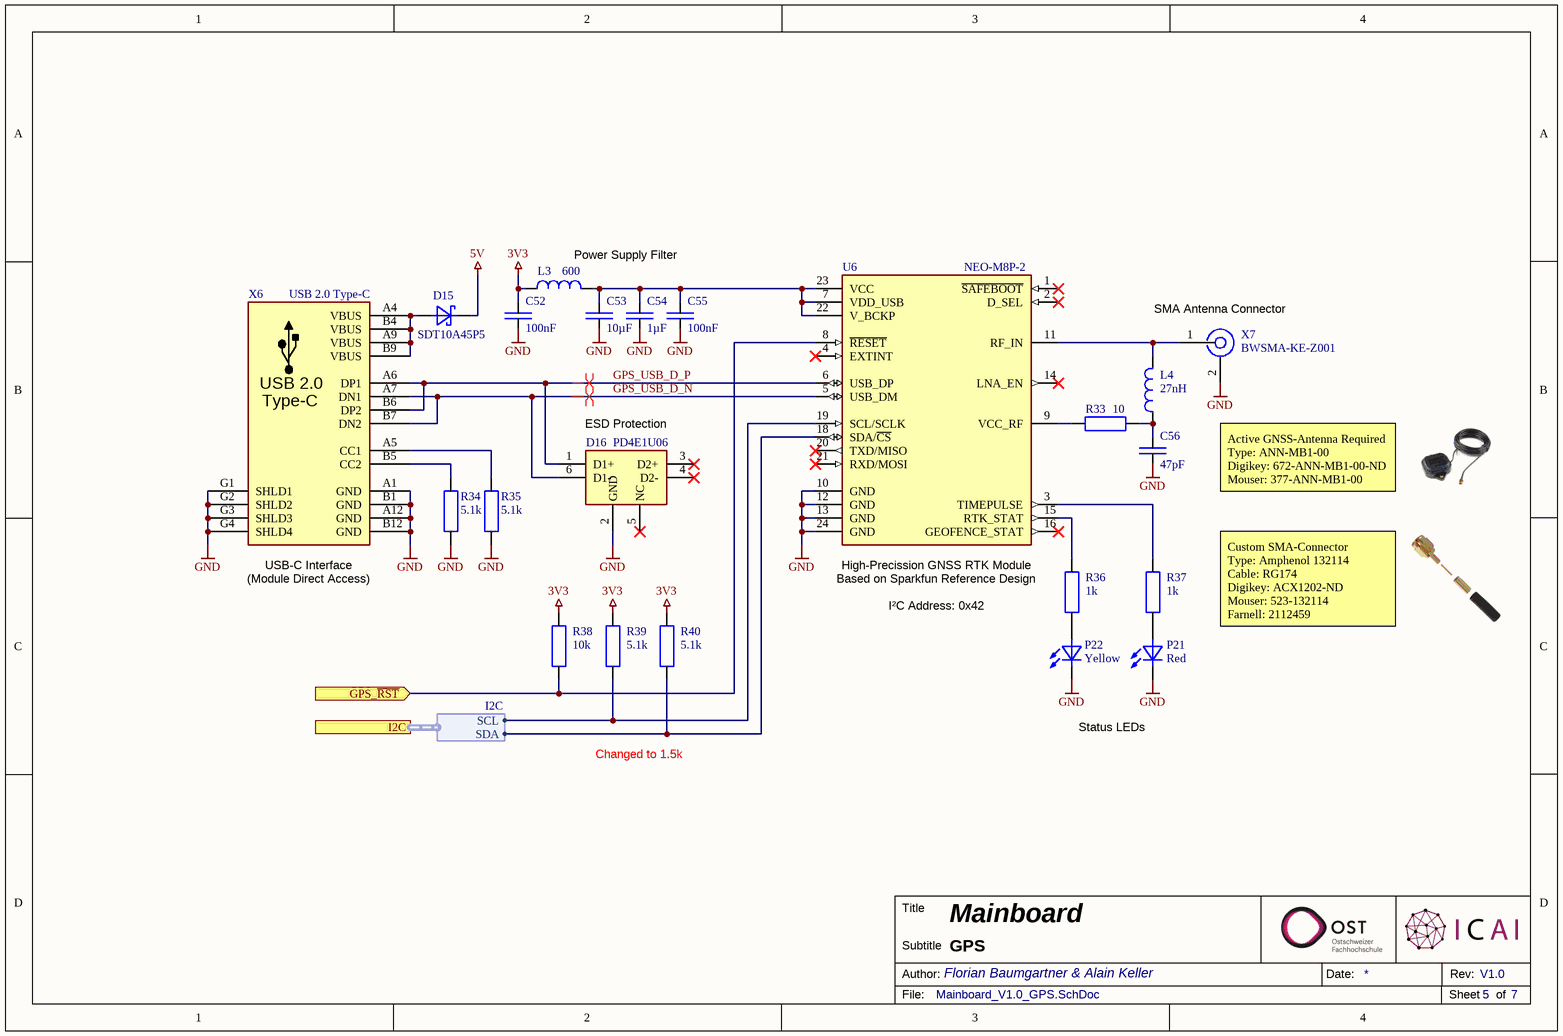
[diagram p4: Mainboard_V1.0_GPS.SchDoc]

### Parts
C52  100nF  [SMD Keramikkondensator 0603]
C53  10µF  [SMD Keramikkondensator 1206]
C54  1µF  [SMD Keramikkondensator 0603]
C55  100nF  [SMD Keramikkondensator 0603]
C56  47pF  [SMD Keramikkondensator 0603]
D15  SDT10A45P5  [SMD Diode PowerDI-5]
D16  PD4E1U06  [SMD IC SOT-363 (SC-70-6)]
L3  600  [SMD INDUCTOR/FERRITE 0805]
L4  27nH  [SMD Inductor 0402]
P21  Red  [SMD LED 0603]
P22  Yellow  [SMD LED 0603]
R33  10  [SMD Widerstand 0603]
R34  5.1k  [SMD Widerstand 0603]
R35  5.1k  [SMD Widerstand 0603]
R36  1k  [SMD Widerstand 0603]
R37  1k  [SMD Widerstand 0603]
R38  10k  [SMD Widerstand 0603]
R39  5.1k  [SMD Widerstand 0603]
R40  5.1k  [SMD Widerstand 0603]
U6  NEO-M8P-2  [SMD NEO-M8P-2]
X6  USB 2.0 Type-C  [THT USB-C Socket (KH-TYPE-C-L10-14P)]
X7  BWSMA-KE-Z001  [THT SMA-Connector (Vertical)]

### Ports
GPS_~{RST} (in), I2C (harness I2C)

### Harnesses
I2C: SCL, SDA

### Nets
3V3: C52.1 L3.1 R38.2 R39.1 R40.1
5V: D15.K
GND: C52.2 C53.1 C54.1 C55.2 C56.2 D16.2(GND) P21.K P22.K R34.2 R35.2 U6.10(GND) U6.12(GND) U6.13(GND) U6.24(GND) X6.A1(GND) X6.A12(GND) X6.B1(GND) X6.B12(GND) X6.G1(SHLD1) X6.G2(SHLD2) X6.G3(SHLD3) X6.G4(SHLD4) X7.2
GPS_~{RST}: R38.1 U6.8(~{RESET}) ; port GPS_~{RST}
GPS_USB_D_N: D16.6(D1-) U6.5(USB_DM) X6.A7(DN1) X6.B7(DN2)
GPS_USB_D_P: D16.1(D1+) U6.6(USB_DP) X6.A6(DP1) X6.B6(DP2)
SCL_GPS: R39.2 U6.19(SCL/SCLK) ; port I2C.SCL
SDA_GPS: R40.2 U6.18(SDA/~{CS}) ; port I2C.SDA
NetC53_2: C53.2 C54.2 C55.1 L3.2 U6.7(VDD_USB) U6.22(V_BCKP) U6.23(VCC)
NetC56_1: C56.1 L4.1 R33.2
NetD15_A: D15.A X6.A4(VBUS) X6.A9(VBUS) X6.B4(VBUS) X6.B9(VBUS)
NetL4_2: L4.2 U6.11(RF_IN) X7.1
NetP21_A: P21.A R37.1
NetP22_A: P22.A R36.1
NetR33_1: R33.1 U6.9(VCC_RF)
NetR34_1: R34.1 X6.B5(CC2)
NetR35_1: R35.1 X6.A5(CC1)
NetR36_2: R36.2 U6.15(RTK_STAT)
NetR37_2: R37.2 U6.3(TIMEPULSE)

Not connected (* = marked no-connect by the designer): D16 3(D2+)* 4(D2-)* 5(NC)*; U6 1(~{SAFEBOOT})* 2(D_SEL)* 4(EXTINT)* 14(LNA_EN)* 16(GEOFENCE_STAT)* 17(RESERVED) 20(TXD/MISO)* 21(RXD/MOSI)*

### Layout directives
differential pair: GPS_USB_D_N, GPS_USB_D_P

### Notes on the sheet
- (near L3) Power Supply Filter
- (near X7) SMA Antenna Connector
- (near D16) ESD Protection
- Active GNSS-Antenna Required
  Type: ANN-MB1-00
  Digikey: 672-ANN-MB1-00-ND
  Mouser: 377-ANN-MB1-00
- (near X6) USB-C Interface
- (near X6) (Module Direct Access)
- Based on Sparkfun Reference Design
- High-Precission GNSS RTK Module
- I²C Address: 0x42
- Custom SMA-Connector
  Type: Amphenol 132114
  Cable: RG174
  Digikey: ACX1202-ND
  Mouser: 523-132114
  Farnell: 2112459
- Changed to 1.5k
- Status LEDs
- Title
- Author:
- Subtitle
- Date:
- Rev:
- File:
- Sheet
- of
- (in symbol X-USB-Buchse_Vertical) USB 2.0

### Library data of the parts
C52 C55 = E6 - 100nF: as C57 on sheet Mainboard_V1.0_Input; ComponentLink1Description: Datasheet; ComponentLink1URL: https://datasheet.lcsc.com/lcsc/1809301912_YAGEO-CC0603KRX7R9BB104_C14663.pdf; Digikey: 445-5666-1-ND; Farnell: 2522432; JLC-Parts: C14663; Mouser: 77-VJ0603V104ZXAPBC; Unit Price: 0.01
C53 = E6 - 10uF: as C60 on sheet Mainboard_V1.0_Input; ComponentLink1Description: Datasheet; ComponentLink1URL: https://datasheet.lcsc.com/lcsc/1810191219_Samsung-Electro-Mechanics-CL10A106KP8NNNC_C19702.pdf; Digikey: 587-3258-1-ND; Farnell: 2113070; JLC-Parts: C13585; Mouser: 963-LMK107BBJ106MALT; Unit Price: 0.01
C54 = E6 - 1uF: SMD Ceramic Capacitor E6; Component Value: 1µF 50V; Component Description: Multilayer Ceramic Capacitors MLCC; ComponentLink1Description: Datasheet; ComponentLink1URL: https://datasheet.lcsc.com/lcsc/1810261812_Samsung-Electro-Mechanics-CL10A105KB8NNNC_C15849.pdf; Digikey: 1276-1860-1-ND; Farnell: 3013383; JLC-Parts: C15849; Mouser: 187-CL10A105KB8NNNC; Unit Price: 0.01
C56 = C-CAPACITOR: CAP-MK; Component Description: Multilayer Ceramic Capacitors; Component Value: 47pF 50V; Digikey: 399-C0603C470J5GAC7867CT-ND; Farnell: 1414639; Mouser: 80-C0603C470J5G; JLC-Parts: C1671; Unit Price: 0.01
D15 = R-DIODE:SCHKY: as D1 on sheet Mainboard_V1.0_MCU; Mouser: 621-SDT10A45P5-13; Farnell: 3944970; Digikey: 31-SDT10A45P5-13CT-ND; JLC-Parts: C2997843; Component Description: Trench Schottky Barrier Rectifier; Unit Price: 0.19; ComponentLink1Description: Datasheet; ComponentLink1URL: https://www.diodes.com/assets/Datasheets/SDT10A45P5.pdf
D16 = PD4E1U06DCKR: Unidirectional 3A (8/20us) 15V (Typ) 6.5V 5.5V (Max) SOT-363 ESD Protection Devices ROHS; Component Description: ESD Suppressor; ComponentLink1Description: Datasheet; ComponentLink1URL: https://datasheet.lcsc.com/lcsc/1810172210_Texas-Instruments-TPD4E1U06DCKR_C194628.pdf; Component Value: PD4E1U06; Digikey: 296-39347-1-ND; Farnell: 3116516; JLC-Parts: C194628; Mouser: 595-TPD4E1U06DCKR; Unit Price: 0.12
L3 = R-COIL (HF): COIL (Spule alt L); Component Description: Ferrite Bead; Component Value: CBM201209U601T (600 Ohm@100MHz, 2000mA); Farnell: 1838838; Mouser: 623-2508056017Y2; Digikey: 1934-1487-1-ND; ComponentLink1Description: Datasheet; ComponentLink1URL: https://datasheet.lcsc.com/lcsc/2304140030_FH--Guangdong-Fenghua-Advanced-Tech-CBM201209U601T_C139168.pdf; JLC-Parts: C139168; Unit Price: 0.01
L4 = R-COIL (HF): Chip Inductor; Farnell: 1404304; Mouser: 81-LQG15HS27NJ02D; Digikey: 490-2628-1-ND; Component Description: Chip Inductor; Component Value: 27nH; JLC-Parts: C12669; Unit Price: 0.01
P21 = P-LED: LED (als Lampe E / alt H); Component Description: General Purpose LED; Component Value: Red (5mA, 2.0V); Digikey: 350-2029-1-ND; Farnell: 1465988; Mouser: 645-598-8010-107F; ComponentLink1Description: Datasheet; ComponentLink1URL: https://datasheet.lcsc.com/szlcsc/Hubei-KENTO-Elec-KT-0603R_C2286.pdf; JLC-Parts: C2286; Unit Price: 0.34
P22 = P-LED: LED (als Lampe E / alt H); Component Description: General Purpose LED; Component Value: Yellow (5mA, 2.1V); Digikey: 350-2033-1-ND; Farnell: 1867103; Mouser: 645-598-8050-107F; ComponentLink1Description: Datasheet; ComponentLink1URL: https://datasheet.lcsc.com/szlcsc/Everlight-Elec-19-213-Y2C-CQ2R2L-3T-CY_C72038.pdf; JLC-Parts: C72038; Unit Price: 0.34
R33 = R-RESISTOR: as R41 on sheet Mainboard_V1.0_Input; Digikey: P10.0HCT-ND; Farnell: 2302958; Mouser: 667-ERJ-3EKF10R0V; JLC-Parts: C22859; Unit Price: 0.01
R34 R35 R39 R40 = R-RESISTOR: as R3 on sheet Mainboard_V1.0_MCU; Digikey: P5.10KHCT-ND; Farnell: 2059378; Mouser: 667-ERJ-3EKF5101V; JLC-Parts: C23186; Unit Price: 0.01
R36 R37 = R-RESISTOR: as R30 on sheet Mainboard_V1.0_HMI; Digikey: P1.00KHCT-ND; Farnell: 2303145; Mouser: 667-ERJ-3EKF1001V; JLC-Parts: C21190; Unit Price: 0.01
R38 = R-RESISTOR: as R29 on sheet Mainboard_V1.0_HMI; Digikey: P10.0KHCT-ND; Farnell: 2303192; Mouser: 667-ERJ-3EKF1002V; JLC-Parts: C25804; Unit Price: 0.01
U6 = U-NEO-M8P-2: High Precision GNSS Module (GPS-RTK); ComponentLink1Description: Datasheet; ComponentLink1URL: https://content.u-blox.com/sites/default/files/NEO-M8P_DataSheet_UBX-15016656.pdf; Digikey: 672-NEO-M8P-2CT-ND; Component Value: NEO-M8P-2; Mouser: 377-NEO-M8P-2; Unit Price: 134.10; Component Description: High Precision GNSS Module (GPS-RTK)
X6 = X-USB-Buchse_Vertical: as X1 on sheet Mainboard_V1.0_MCU; ComponentLink1Description: Datasheet; ComponentLink1URL: https://datasheet.lcsc.com/lcsc/2103161911_Shenzhen-Kinghelm-Elec-KH-TYPE-C-L10-14P_C2761226.pdf; JLC-Parts: C2761226; Unit Price: 0.27
X7 = X-SMA-Connector: SMA Connector; Digikey: SAM8971-ND; Farnell: 2856821; Mouser: 200-SMAJPHSTTH1; Component Description: SMA Connector; ComponentLink1Description: Datasheet; ComponentLink1URL: https://datasheet.lcsc.com/lcsc/2212281109_BAT-WIRELESS-BWSMA-KE-Z001_C496549.pdf; Component Value: BWSMA-KE-Z001; JLC-Parts: C496549; Unit Price: 0.30

## Sheet Mainboard_V1.0_Sensors.SchDoc: Mainboard
size A4; PageSetup: Record=PageOptions|CenterHorizontal=True|CenterVertical=True|PrintScale=0.97|XCorrection=1.00|YCorrection=1.00|PrintKind=0|BorderSize=5000000|LeftOffset=0|BottomOffset=0|Orientation=2|PaperLength=1000|PaperWidth=1000|Scale=100|PaperSource=7|PrintQuality=-3|MediaType=1|DitherType=10|PrintScaleMode=1|PaperKind=A4|PaperIndex=9; Organization: Ostschweizer Fachhochschule; Address2: Florian Baumgartner & Thierry Schwaller; Address3: florian.baumgartner@ost.ch; DocumentNumber: 7; Revision: V1.0; SheetNumber: 7; SheetTotal: 7; Author: Florian Baumgartner & Alain Keller; Subtitle: Sensors
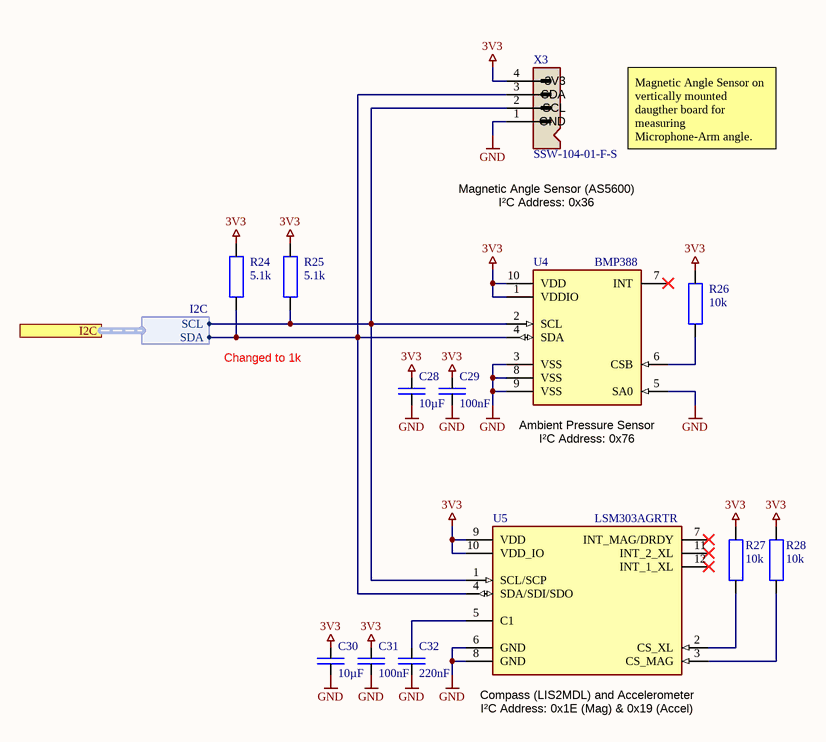
[diagram p5: Mainboard_V1.0_Sensors.SchDoc]

### Parts
C28  10µF  [SMD Keramikkondensator 1206]
C29  100nF  [SMD Keramikkondensator 0603]
C30  10µF  [SMD Keramikkondensator 1206]
C31  100nF  [SMD Keramikkondensator 0603]
C32  220nF  [SMD Keramikkondensator 0603]
R24  5.1k  [SMD Widerstand 0603]
R25  5.1k  [SMD Widerstand 0603]
R26  10k  [SMD Widerstand 0603]
R27  10k  [SMD Widerstand 0603]
R28  10k  [SMD Widerstand 0603]
U4  BMP388  [SMD IC LGA-10]
U5  LSM303AGRTR  [SMD IC LGA-12]
X3  SSW-104-01-F-S  [THT Buchsenleiste 4-Pol (1x4)]

### Ports
I2C (harness I2C)

### Harnesses
I2C: SCL, SDA

### Nets
3V3: C28.2 C29.2 C30.2 C31.2 R24.1 R25.1 R26.2 R27.2 R28.2 U4.1(VDDIO) U4.10(VDD) U5.9(VDD) U5.10(VDD_IO) X3.4
GND: C28.1 C29.1 C30.1 C31.1 C32.1 U4.3(VSS) U4.5(SA0) U4.8(VSS) U4.9(VSS) U5.6(GND) U5.8(GND) X3.1
SCL_SYS: R25.2 U4.2(SCL) U5.1(SCL/SCP) X3.2 ; port I2C.SCL
SDA_SYS: R24.2 U4.4(SDA) U5.4(SDA/SDI/SDO) X3.3 ; port I2C.SDA
NetC32_2: C32.2 U5.5(C1)
NetR26_1: R26.1 U4.6(CSB)
NetR27_1: R27.1 U5.2(CS_XL)
NetR28_1: R28.1 U5.3(CS_MAG)

Not connected (* = marked no-connect by the designer): U4 7(INT)*; U5 7(INT_MAG/DRDY)* 11(INT_2_XL)* 12(INT_1_XL)*

### Notes on the sheet
- (near X3) 3V3
- (near X3) SDA
- (near X3) SCL
- (near X3) GND
- Magnetic Angle Sensor on vertically mounted daugther board for measuring Microphone-Arm angle.
- Magnetic Angle Sensor (AS5600)
- I²C Address: 0x36
- Changed to 1k
- (near U4) I²C Address: 0x76
- (near U4) Ambient Pressure Sensor
- (near U5) I²C Address: 0x1E (Mag) & 0x19 (Accel)
- (near U5) Compass (LIS2MDL) and Accelerometer
- Title
- Author:
- Subtitle
- Date:
- Rev:
- File:
- Sheet
- of

### Library data of the parts
C28 C30 = E6 - 10uF: as C60 on sheet Mainboard_V1.0_Input; ComponentLink1Description: Datasheet; ComponentLink1URL: https://datasheet.lcsc.com/lcsc/1810191219_Samsung-Electro-Mechanics-CL10A106KP8NNNC_C19702.pdf; Digikey: 587-3258-1-ND; Farnell: 2113070; JLC-Parts: C13585; Mouser: 963-LMK107BBJ106MALT; Unit Price: 0.01
C29 C31 = E6 - 100nF: as C57 on sheet Mainboard_V1.0_Input; ComponentLink1Description: Datasheet; ComponentLink1URL: https://datasheet.lcsc.com/lcsc/1809301912_YAGEO-CC0603KRX7R9BB104_C14663.pdf; Digikey: 445-5666-1-ND; Farnell: 2522432; JLC-Parts: C14663; Mouser: 77-VJ0603V104ZXAPBC; Unit Price: 0.01
C32 = E6 - 100nF: SMD Ceramic Capacitor E6; Component Value: 220nF 50V; Component Description: Multilayer Ceramic Capacitors MLCC; ComponentLink1Description: Datasheet; ComponentLink1URL: https://datasheet.lcsc.com/lcsc/1809301912_YAGEO-CC0603KRX7R9BB104_C14663.pdf; Digikey: 445-173612-1-ND; Farnell: 3416121; JLC-Parts: C21120; Mouser: 810-C1608X7R1H224KAE; Unit Price: 0.01
R24 R25 = R-RESISTOR: as R3 on sheet Mainboard_V1.0_MCU; Digikey: P5.10KHCT-ND; Farnell: 2059378; Mouser: 667-ERJ-3EKF5101V; JLC-Parts: C23186; Unit Price: 0.01
R26-R28 = R-RESISTOR: as R29 on sheet Mainboard_V1.0_HMI; Digikey: P10.0KHCT-ND; Farnell: 2303192; Mouser: 667-ERJ-3EKF1002V; JLC-Parts: C25804; Unit Price: 0.01
U4 = U-BMP388: Digital Pressure Sensor; ComponentLink1Description: Datasheet; ComponentLink1URL: https://www.bosch-sensortec.com/media/boschsensortec/downloads/datasheets/bst-bmp388-ds001.pdf; Digikey: 828-1079-1-ND; Component Value: BMP388; JLC-Parts: C779278; Mouser: 262-BMP388; Unit Price: 2.40; Component Description: Digital Pressure Sensor
U5 = U-LSM303AGRTR: High-Performance eCompass Module; ComponentLink1Description: Datasheet; ComponentLink1URL: https://www.st.com/content/ccc/resource/technical/document/datasheet/74/c4/19/54/62/c5/46/13/DM00177685.pdf/files/DM00177685.pdf/jcr:content/translations/en.DM00177685.pdf; Digikey: 497-16527-1-ND; Component Value: LSM303AGRTR; Farnell: 2664523; JLC-Parts: C126671; Mouser: 511-LSM303AGRTR; Unit Price: 1.42; Component Description: High-Performance eCompass Module
X3 = X-Stiftleiste (4-Fach): Component Description: Female Pin Header; Digikey: SAM10018-ND; Farnell: 3550891; Mouser: 200-SSW10401FS; Component Value: SSW-104-01-F-S; JLC-Parts: C5116530; Unit Price: 0.07; ComponentLink1Description: Datasheet; ComponentLink1URL: https://datasheet.lcsc.com/lcsc/2207291800_ZHOURI-PM2-54-1-4_C5116530.pdf